# Altium schematic sheet Fonte.SchDoc
size A4; SheetNumber: 2; SheetTotal: 4
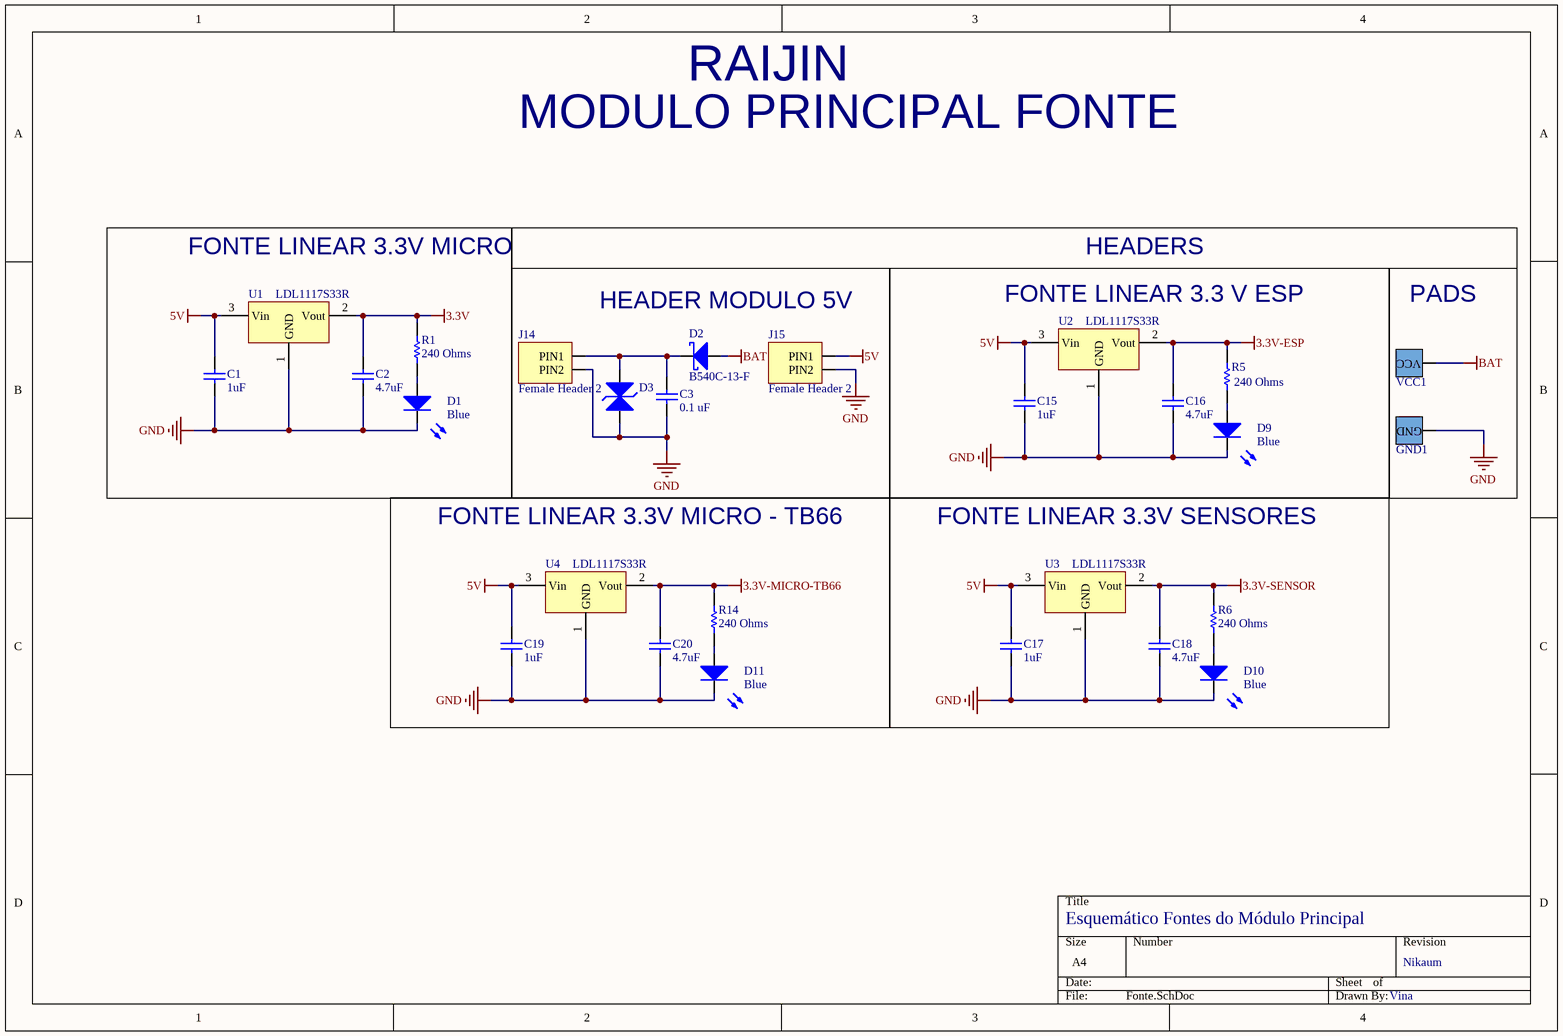
[diagram p0: Fonte.SchDoc]

## Parts
C1  1uF  [C0805]
C2  4.7uF  [C0805]
C3  0.1 uF  [C0805]
C15  1uF  [C0805]
C16  4.7uF  [C0805]
C17  1uF  [C0805]
C18  4.7uF  [C0805]
C19  1uF  [C0805]
C20  4.7uF  [C0805]
D1  Blue  [DIODO_2-SMD-3215]
D2  B540C-13-F  [DIODO_DO-214AB]
D3  ESD110B102ELE6327XTMA1  [DIODO-TSSLP-2-4]  (value not drawn)
D9  Blue  [DIODO_2-SMD-3215]
D10  Blue  [DIODO_2-SMD-3215]
D11  Blue  [DIODO_2-SMD-3215]
GND1  Ground Pad  [PAD_ALIMENTAÇÃO_MINI]  (value not drawn)
J14  Female Header 2  [Female Header 2]
J15  Female Header 2  [Female Header 2]
R1  240 Ohms  [RESC1608X55N]
R5  240 Ohms  [RESC1608X55N]
R6  240 Ohms  [RESC1608X55N]
R14  240 Ohms  [RESC1608X55N]
U1  LDL1117S33R  [SOT-223-4]
U2  LDL1117S33R  [SOT-223-4]
U3  LDL1117S33R  [SOT-223-4]
U4  LDL1117S33R  [SOT-223-4]
VCC1  Source Pad  [PAD_ALIMENTAÇÃO_MINI]  (value not drawn)

## Blocks framed on the sheet
FONTE LINEAR 3.3V MICRO: C1 C2 D1 R1 U1
HEADER MODULO 5V: C3 D2 D3 J14 J15
PADS: GND1 VCC1
FONTE LINEAR 3.3V MICRO - TB66: C19 C20 D11 R14 U4
FONTE LINEAR 3.3V SENSORES: C17 C18 D10 R6 U3

## Nets
3.3V: C2.2 R1.2 U1.2(Vout)
3.3V-ESP: C16.2 R5.2 U2.2(Vout)
3.3V-MICRO-TB66: C20.2 R14.2 U4.2(Vout)
3.3V-SENSOR: C18.2 R6.2 U3.2(Vout)
5V: C1.2 C15.2 C17.2 C19.2 J15.PIN1 U1.3(Vin) U2.3(Vin) U3.3(Vin) U4.3(Vin)
BAT: D2.A VCC1.A(VCC)
GND: C1.1 C2.1 C3.2 C15.1 C16.1 C17.1 C18.1 C19.1 C20.1 D1.C D3.A D9.C D10.C D11.C GND1.A(GND) J14.PIN2 J15.PIN2 U1.1(GND) U2.1(GND) U3.1(GND) U4.1(GND)
NetC3_1: C3.1 D2.C D3.C J14.PIN1
NetD1_A: D1.A R1.1
NetD9_A: D9.A R5.1
NetD10_A: D10.A R6.1
NetD11_A: D11.A R14.1

## Notes on the sheet
- RAIJIN
- MODULO PRINCIPAL FONTE
- FONTE LINEAR 3.3 V ESP
- HEADERS
- Esquemático Fontes do Módulo Principal
- Nikaum
- Vina

## Library data of the parts
C1 C15 C17 C19 = 885012107015: CAP CER 1uF 25V X5R 0805; Manufacturer: Wurth Electronik; Tolerance: 20%; Library Control - Checked Footprint: Yes; Library Control - Person that Checked Footprint: Nikaum; Supplier 1: Mouser; Part Number: 885012107015; Category: Ceramic Capacitor; Price: 1 = 0,10, 10=0,082, 100=0,073 (USD); Supplier Part Number 1: 710-885012107015; Library Ref: Capacitor; Operating Temperature: -55 C ~ 85 C; Package / Case: 0805 (2012 Metric); Size / Dimension: 2,00 L x 1,25 W x 1,25 H; Value: 1uF; Voltage - Rated: 25V; ESR: -; Dieletric: X5R; Library Control - Checked Schematic: Yes; Library Control - Last Update: 28/06/2021 00:10; Library Control - Person that Checked Schematic: Nikaum; Library Control - Person that did the Last Update Footprint: Nikaum; Library Control - Person that did the Last Update Schematic: Nikaum; ComponentLink1Description: Datasheet; ComponentLink1URL: https://br.mouser.com/datasheet/2/445/885012107015-1727441.pdf; ComponentLink2Description: Mouser Link; ComponentLink2URL: https://br.mouser.com/ProductDetail/Wurth-Elektronik/885012107015?qs=%2Fha2pyFaduggjUC9vDyrNMYsuF9m0S%2FHKLBl4FOBDDHl%252B%252B2XqSGtSQ%3D%3D
C2 C16 C18 C20 = 0805X475M250CT: CAP CER 4.7uF 25V 20% 0805; Manufacturer: Walsin; Dieletric: X5R; Library Control - Checked Footprint: No; Library Control - Checked Schematic: Yes; Library Control - Person that Checked Schematic: Guilherme; Library Control - Person that did the Last Update Schematic: Marcos; Supplier 1: Mouser; Part Number: 0805X475M250CT; Category: Ceramic Capacitor; Price: 1=0,26 10=0,178 100=0,101 1000=0,064 (USD); Supplier Part Number 1: 791-0805X475M250CT; Library Ref: Capacitor; Operating Temperature: -55°C ~ 85°C; Package / Case: 0805(2012 metric); Size / Dimension: 2 mm L x 1.25 mm W x 0.8 mm H; Tolerance: 20%; Value: 4.7uF; Voltage - Rated: 25V; ESR: -; Library Control - Last Update: 26/06/2021 19:59; ComponentLink1Description: Datasheet; ComponentLink1URL: https://br.mouser.com/datasheet/2/210/WTC_MLCC_General_Purpose-1534899.pdf; ComponentLink2Description: Mouser Link; ComponentLink2URL: https://br.mouser.com/ProductDetail/Walsin/0805X475M250CT?qs=%2Fha2pyFadugovbtJ4IPO2aI5%2FHfN6czWOLxzJ368rfolfgZFQZPK8JJR9MicoCMy
C3 = C0805C104K5RACTU: CAP CER 0.1uF 50V X7R 0805; Manufacturer: Kemet; Tolerance: 10%; Voltage - Rated: 50 VDC; Library Control - Checked Footprint: No; Library Control - Checked Schematic: Yes; Library Control - Person that Checked Schematic: Guilherme; Library Control - Person that did the Last Update Schematic: Marcos; Supplier 1: Mouser; Part Number: C0805C104K5RACTU; Category: Ceramic Capacitor; Price: 1=0,24 10=0,126 100=0,076 1000=0,059 (USD); Supplier Part Number 1: 80-C0805C104K5R; Library Ref: Capacitor; Operating Temperature: -55°C ~ 125°C; Package / Case: 0805(2012 metric); Size / Dimension: 2 mm L  x 1.25 mm W  x  0.78 mm H; Value: 0.1 uF; ESR: -; Dieletric: X7R; Library Control - Last Update: 26/06/2021 20:48; ComponentLink1Description: Datasheet; ComponentLink1URL: https://br.mouser.com/datasheet/2/212/KEM_C1002_X7R_SMD-1102033.pdf; ComponentLink2Description: Mouser Link; ComponentLink2URL: https://br.mouser.com/ProductDetail/KEMET/C0805C104K5RACTU?qs=Pc30aiB8zWUISNb2Qeyxfw%3D%3D
D1 D9-D11 = EAST3215BA5: LED 75mW BLUE 45MCD 3215; Manufacturer: Everlight Electronics; Current - Forward (If): 20 mA; Voltage - Forward (Vf): 3,30 V; Viewing Angle: 130°; Wavelength: 468 nm; Reverse Voltage: 5 V; Library Control - Checked Footprint: yes; Library Control - Person that Checked Footprint: Lucas; Library Control - Person that did the Last Update Footprint: Stéfany (Ster); Supplier 1: Mouser; Part Number: EAST3215BA5; Category: Standard LEDs - SMD; Price: 1 = 0,3800, 10 = 0,2050, 100 = 0.1080 (USD); Package / Case: 3215; Color: Blue; Operating Temperature: - 40 °C ~ 85 °C; Luminous Intensity: 45 mcd; Library Ref: Diodo/Led; Supplier Part Number 1: 638-EAST3215BA5; Max Power Dissipation: 75 mW; Max Current Rating: 20 mA; Library Control - Checked Schematic: yes; Library Control - Last Update: 13/06/2021 12:45; Library Control - Person that Checked Schematic: Lucas; Library Control - Person that did the Last Update Schematic: Stéfany (Ster); ComponentLink1Description: Mouser Link; ComponentLink1URL: https://www.mouser.com/ProductDetail/Everlight/EAST3215BA5?qs=Cqqh%252BS766wnzp9nQVj5A4g==; ComponentLink2Description: Datasheet; ComponentLink2URL: https://www.mouser.com/datasheet/2/143/EAST3215BA5-1154292.pdf
D2 = B540C-13-F: DIODE SCHOTTKY 40V 5A DO-214AB; Manufacturer: Diodes Incorporated; Max Forward Surge Current (Ifsm): 100 A; Current - Reverse Leakage @ Vr: 500 uA; Voltage - Forward (Vf) (Max) @ If: 550 mV; Diode Type: Schottky Barrier Rectifier; Library Control - Checked Footprint: yes; Library Control - Person that did the Last Update Footprint: Dalarme; Library Control - Person that did the Last Update Schematic: Stéfany(Ster); Capacitance @ Vr, F: 300 pF @ 4V, 1MHz; Supplier 1: Mouser; Part Number: B540C-13-F; Category: Schottky Diodes & Rectifiers; Price: 1 = 0,53, 10 = 0,454, 100 = 0,339 (USD); Package / Case: SMC (DO-214AB); Current - Average Rectified (Io): 5 A; Operating Temperature: - 55ºC ~ 125ºC; Voltage - DC Reverse (Vr) (Max): 40 V; Library Ref: Diode; Supplier Part Number 1: 621-B540C-F; Library Control - Checked Schematic: yes; Library Control - Last Update: 21/06/2021 13:20; ComponentLink1Description: Mouser Link; ComponentLink1URL: https://www.mouser.com/ProductDetail/Diodes-Incorporated/B540C-13-F?qs=%2Fha2pyFadugB25bXQPJfFXI5hzpNpnVpraRSN9VwgHc%3D; ComponentLink2Description: Datasheet; ComponentLink2URL: https://www.mouser.com/datasheet/2/115/ds13012-73423.pdf
D3 = ESD110B102ELE6327XTMA1: DIODE TVS 26V 14.2A DO-214AA-2; Manufacturer: Infineon; Voltage - Forward (Vf) (Max) @ If: -15 V - +15 V; Library Control - Checked Footprint: No; Library Control - Person that did the Last Update Footprint: Nikaum; Power Dissipation: 58 W; Supplier 1: Mouser; Part Number: ESD110B102ELE6327XTMA1; Category: ESD Suppressors / TVS Diodes; Price: 1 = 0,48, 10 = 0,36, 100 = 0,225 (USD); Package / Case: TSLP-2; Operating Temperature: - 40ºC ~ 125ºC; Diode Type: TVS; Library Ref: Diode; Supplier Part Number 1: 726-ESD110B102ELE632; Library Control - Checked Schematic: No; Library Control - Last Update: 13/06/2021 13:28; Library Control - Person that did the Last Update Schematic: Nikaum; ComponentLink1Description: Datasheet; ComponentLink1URL: https://www.mouser.com/datasheet/2/196/Infineon-ESD110-B1-02series-DS-v01_04-EN-1731333.pdf; ComponentLink2Description: Mouser Link; ComponentLink2URL: https://www.mouser.com/ProductDetail/Infineon-Technologies/ESD110B102ELE6327XTMA1?qs=%2Fha2pyFaduiogV8KDD5PH1He7eBI5EnoxEmNaeUv4GVgUCwgbnNdrWufEfAgVCzv
GND1 = Ground Pad Mini Sumô: GND PAD MINI SUMÔ; Cable AWG: 20 / 18 (AWG); Recomended Category: Mini Sumô; Size: 3.5 x 3.5 (mm); Library Ref: Pads
J14 J15 = Female Header 2: System: Connector
R1 R5 R6 R14 = RC0603FR-07240RL: RES SMD 240 OHM 1% 1/10W 0603; Manufacturer: YAGEO; Temperature Coefficient: 100 PPM / C; Power Rating: 1/10 W (100 mW); Supplier 1: Mouser; Part Number: RC0603FR-07240RL; Category: Current Sense Resistors - SMD; Price: 1= 0,10, 10= 0,024, 100= 0,01 (USD); Package / Case: 0603 (1608 metric); Operating Temperature: -55C ~ +155C; Value: 240 Ohms; Tolerance: 1%; Voltage Rating: -; Library Ref: Resistor; Resistor Type: Fixed; Size / Dimension: 1.6mm L x 0.8mm W x 0.45mm H; Supplier Part Number 1: 603-RC0603FR-07240RL; ComponentLink1Description: Mouser Link; ComponentLink1URL: https://br.mouser.com/ProductDetail/YAGEO/RC0603FR-07240RL?qs=%2Fha2pyFaduiUxY9aBc7vYsXmDGghjtsAaASQnplf3Fe6IIYOTbEeqCNZ6k5LKUyr; ComponentLink2Description: Datasheet; ComponentLink2URL: https://br.mouser.com/datasheet/2/447/Yageo_03_18_2021_PYu_RC_Group_51_RoHS_L_11-2199992.pdf
U1-U4 = LDL1117S33R: IC REG LINEAR 3.3V 1.2A SOT-223-4; Manufacturer: STMicroelectronics; Max Power Dissipation: Internally limited; Output Type: Fixed; Number of Regulators: 1; Voltage - Input (Max): 18V; Current - Quiescent (Iq): 250 uA; Voltage - Dropout (Max): 600mV (1.2 A); Library Control - Checked Footprint: Yes; Library Control - Person that Checked Footprint: Nícolas; Library Control - Person that did the Last Update Footprint: Pierre; Voltage - Output (Max): 3.6V; Supplier 1: Mouser; Part Number: LDL1117S33R; Library Ref: Voltage Regulator; Category: Linear Voltage Regulator; Price: 1= 0.46000, 10= 0.34000, 100= 0.22900 (USD); Package/ Case: SOT-223-4; Operating Temperature: -40°C~125°C; Voltage - Output (Min/Fixed): 3.3 V; Supplier Part Number 1: 511-LDL1117S33R; Library Control - Checked Schematic: Yes; Library Control - Last Update: 23/06/21 10:22; Library Control - Person that Checked Schematic: Nícolas; Library Control - Person that did the Last Update Schematic: Nícolas; Current - Output: 1.2 A; Power Dissipation: Internally limited; ComponentLink1Description: Mouser Link; ComponentLink1URL: https://br.mouser.com/ProductDetail/STMicroelectronics/LDL1117S33R?qs=%2Fha2pyFadugA91l4ky%2FRZ5SN3GrMJ6YI2MUHTqmRDLfkBVrFdA%252BW6Q%3D%3D; ComponentLink2Description: Datasheet; ComponentLink2URL: https://br.mouser.com/datasheet/2/389/dm00366442-1799212.pdf
VCC1 = Source Pad Mini Sumô: VCC PAD MINI SUMÔ; Cable AWG: 20 / 18 (AWG); Recomended Category: Mini Sumô; Size: 3.5 x 3.5 (mm); Library Ref: Pads